# EAGLE design top_3-28-21 (EAGLE 9.6.1)
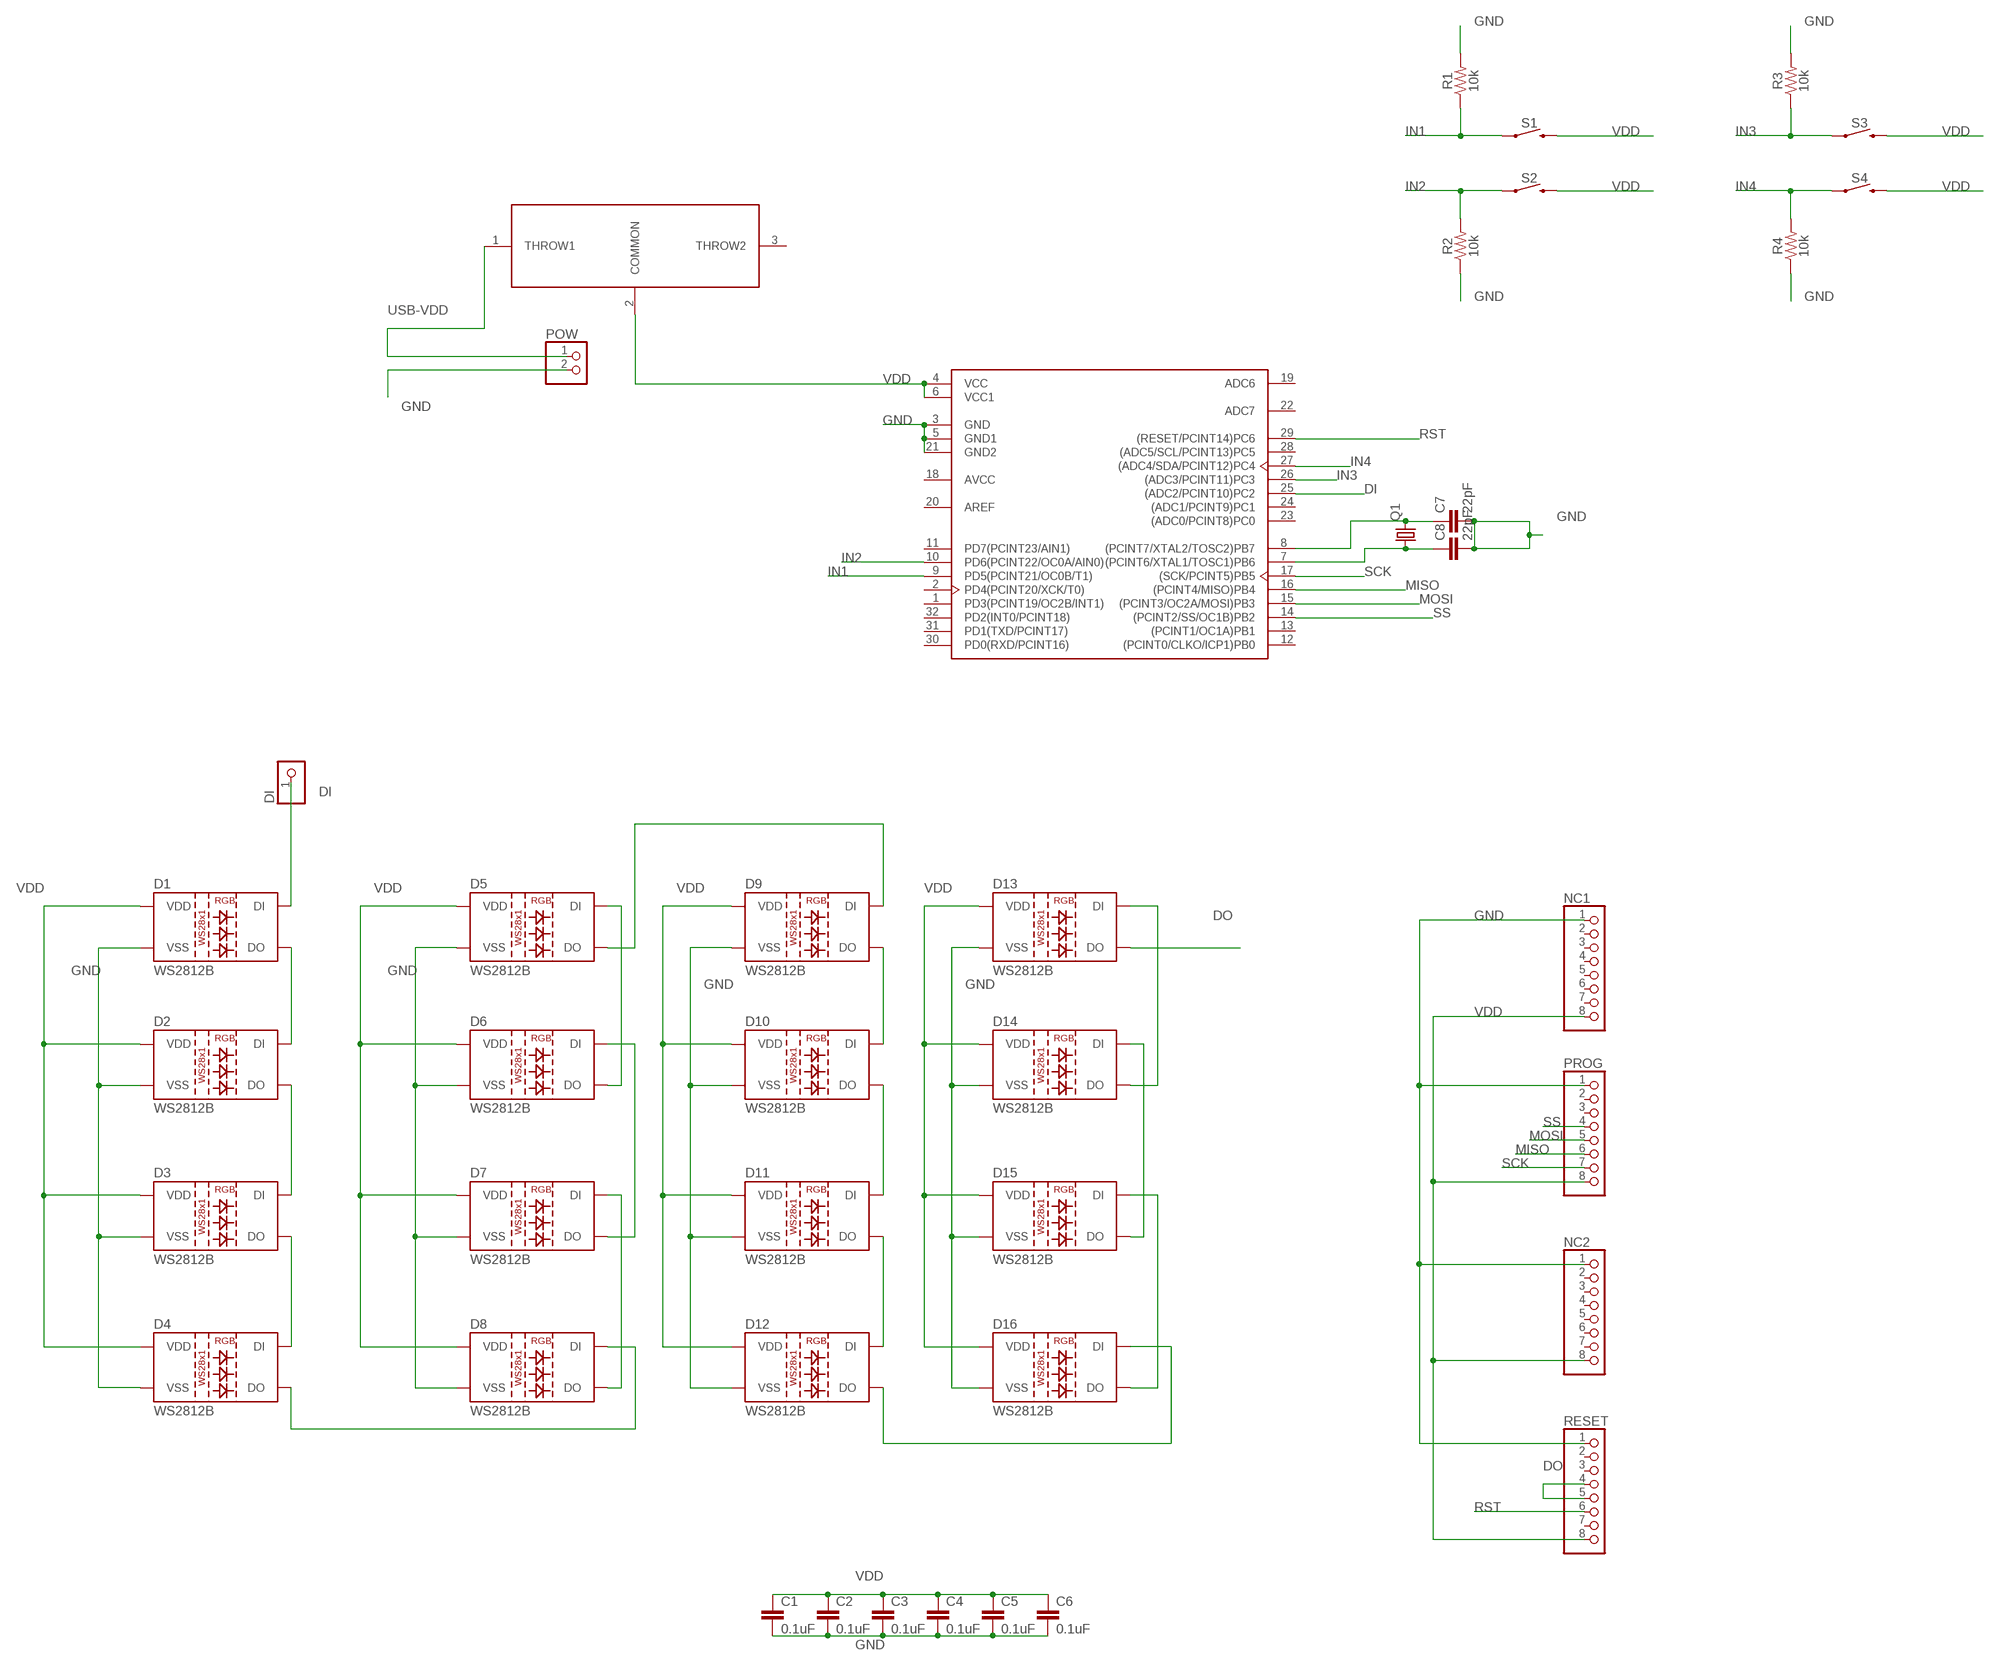
[diagram p0: schematic, sheet 1]

## Parts
C1  0.1uF  0.1UF-0603-25V-5%  [0603]
C2  0.1uF  0.1UF-0603-25V-5%  [0603]
C3  0.1uF  0.1UF-0603-25V-5%  [0603]
C4  0.1uF  0.1UF-0603-25V-5%  [0603]
C5  0.1uF  0.1UF-0603-25V-5%  [0603]
C6  0.1uF  0.1UF-0603-25V-5%  [0603]
C7  22pF  1.0UF-0805-25V-(+80/-20%)  [0805]
C8  22pF  1.0UF-0805-25V-(+80/-20%)  [0805]
D1  WS2812B  [WS2812B]
D2  WS2812B  [WS2812B]
D3  WS2812B  [WS2812B]
D4  WS2812B  [WS2812B]
D5  WS2812B  [WS2812B]
D6  WS2812B  [WS2812B]
D7  WS2812B  [WS2812B]
D8  WS2812B  [WS2812B]
D9  WS2812B  [WS2812B]
D10  WS2812B  [WS2812B]
D11  WS2812B  [WS2812B]
D12  WS2812B  [WS2812B]
D13  WS2812B  [WS2812B]
D14  WS2812B  [WS2812B]
D15  WS2812B  [WS2812B]
D16  WS2812B  [WS2812B]
DI  PINHD-1X1  [1X01]
IC1  ATMEGA328P-AU  [TQFP-32]
NC1  PINHD-1X8  [1X08]
NC2  PINHD-1X8  [1X08]
POW  PINHD-1X2  [1X02]
PROG  PINHD-1X8  [1X08]
Q1  CRYSTALHC49S  [HC49/S]
R1  10k  0.3OHM-0805-1/8W-1%  [0805]
R2  10k  0.3OHM-0805-1/8W-1%  [0805]
R3  10k  0.3OHM-0805-1/8W-1%  [0805]
R4  10k  0.3OHM-0805-1/8W-1%  [0805]
RESET  PINHD-1X8  [1X08]
S1  MOMENTARY-SWITCH-SPST-PTH-6.0MM  [TACTILE_SWITCH_PTH_6.0MM]
S2  MOMENTARY-SWITCH-SPST-PTH-6.0MM  [TACTILE_SWITCH_PTH_6.0MM]
S3  MOMENTARY-SWITCH-SPST-PTH-6.0MM  [TACTILE_SWITCH_PTH_6.0MM]
S4  MOMENTARY-SWITCH-SPST-PTH-6.0MM  [TACTILE_SWITCH_PTH_6.0MM]
U$2  SLIDE_SWITCH_1P2T  [SLIDE_SWITCH_1P2T]

## Nets
DI: D1.4(DI) DI.1 IC1.25((ADC2/PCINT10)PC2)
DO: D13.2(DO) RESET.4 RESET.5
GND: C1.2 C2.2 C3.2 C4.2 C5.2 C6.2 C7.2 C8.2 D1.3(VSS) D2.3(VSS) D3.3(VSS) D4.3(VSS) D5.3(VSS) D6.3(VSS) D7.3(VSS) D8.3(VSS) D9.3(VSS) D10.3(VSS) D11.3(VSS) D12.3(VSS) D13.3(VSS) D14.3(VSS) D15.3(VSS) D16.3(VSS) IC1.3(GND) IC1.5(GND1) IC1.21(GND2) NC1.1 NC2.1 POW.2 PROG.1 R1.2 R2.1 R3.2 R4.1 RESET.1
IN1: IC1.9(PD5(PCINT21/OC0B/T1)) R1.1 S1.1
IN2: IC1.10(PD6(PCINT22/OC0A/AIN0)) R2.2 S2.1
IN3: IC1.26((ADC3/PCINT11)PC3) R3.1 S3.1
IN4: IC1.27((ADC4/SDA/PCINT12)PC4) R4.2 S4.1
MISO: IC1.16((PCINT4/MISO)PB4) PROG.6
MOSI: IC1.15((PCINT3/OC2A/MOSI)PB3) PROG.5
N$1: D4.2(DO) D8.4(DI)
N$2: D7.4(DI) D8.2(DO)
N$3: D1.2(DO) D2.4(DI)
N$4: D2.2(DO) D3.4(DI)
N$5: D3.2(DO) D4.4(DI)
N$6: D6.4(DI) D7.2(DO)
N$7: D5.2(DO) D9.4(DI)
N$8: D12.2(DO) D16.4(DI)
N$9: D15.4(DI) D16.2(DO)
N$10: D9.2(DO) D10.4(DI)
N$11: D10.2(DO) D11.4(DI)
N$12: D11.2(DO) D12.4(DI)
N$13: D14.4(DI) D15.2(DO)
N$14: D13.4(DI) D14.2(DO)
N$15: C7.1 IC1.8((PCINT7/XTAL2/TOSC2)PB7) Q1.2
N$16: D5.4(DI) D6.2(DO)
N$17: C8.1 IC1.7((PCINT6/XTAL1/TOSC1)PB6) Q1.1
RST: IC1.29((RESET/PCINT14)PC6) RESET.6
SCK: IC1.17((SCK/PCINT5)PB5) PROG.7
SS: IC1.14((PCINT2/SS/OC1B)PB2) PROG.4
USB-VDD [pow_width]: POW.1 U$2.1(THROW1)
VDD [pow_width]: C1.1 C2.1 C3.1 C4.1 C5.1 C6.1 D1.1(VDD) D2.1(VDD) D3.1(VDD) D4.1(VDD) D5.1(VDD) D6.1(VDD) D7.1(VDD) D8.1(VDD) D9.1(VDD) D10.1(VDD) D11.1(VDD) D12.1(VDD) D13.1(VDD) D14.1(VDD) D15.1(VDD) D16.1(VDD) IC1.4(VCC) IC1.6(VCC1) NC1.8 NC2.8 PROG.8 RESET.8 S1.3 S2.3 S3.3 S4.3 U$2.2(COMMON)
Unconnected: IC1.1(PD3(PCINT19/OC2B/INT1)) IC1.2(PD4(PCINT20/XCK/T0)) IC1.11(PD7(PCINT23/AIN1)) IC1.12((PCINT0/CLKO/ICP1)PB0) IC1.13((PCINT1/OC1A)PB1) IC1.19(ADC6) IC1.22(ADC7) IC1.23((ADC0/PCINT8)PC0) IC1.24((ADC1/PCINT9)PC1) IC1.28((ADC5/SCL/PCINT13)PC5) IC1.30(PD0(RXD/PCINT16)) IC1.31(PD1(TXD/PCINT17)) IC1.32(PD2(INT0/PCINT18)) NC1.2 NC1.3 NC1.4 NC1.5 NC1.6 NC1.7 NC2.2 NC2.3 NC2.4 NC2.5 NC2.6 NC2.7 PROG.2 PROG.3 RESET.2 RESET.3 RESET.7 U$2.3(THROW2)

## Power pins joined to a net without a drawn wire
AREF: IC1.20(AREF)
AVCC: IC1.18(AVCC)

## Library data of the parts
C1-C6 = SparkFun-Capacitors:0.1UF: 0.1µF ceramic capacitors A capacitor is a passive two-terminal electrical component used to store electrical energy temporarily in an electric field.; PROD_ID: CAP-08604
C7 C8 = SparkFun-Capacitors:1.0UF: 1µF ceramic capacitors A capacitor is a passive two-terminal electrical component used to store electrical energy temporarily in an electric field.; PROD_ID: CAP-11625; VALUE: 1.0uF
D1-D16 = my-LED-cube:WS2812B: WS2812B SMD addressable RGB LED 5x5mm SMD LED with built-in controller IC. Color: Red/Green/Blue mC Rating: RGB: 390, 660, 180 mcd Forward Voltage: RGB: 2.0, 3.0, 3.0 V Packages:WS2812B SparkFun Products: Blynk Board - ESP8266 <https://www.sparkfun.com/products/13794>; PROD_ID: DIO-12503
DI = pinhead:PINHD-1X1: PIN HEADER
IC1 = Microcontroller:ATMEGA328P-AU: IC MCU 8BIT 32KB FLASH 32TQFP Manufacturer's datasheet <http://ww1.microchip.com/downloads/en/DeviceDoc/ATmega48A-PA-88A-PA-168A-PA-328-P-DS-DS40002061A.pdf>; CREATED_BY: PCBLayout.com; DIGIKEY_PART_NUMBER: ATMEGA328P-AU-ND; MANUFACTURER: Microchip Technology; MPN: ATMEGA328P-AU; PACKAGE: TQFP-32
NC1 NC2 PROG RESET = pinhead:PINHD-1X8: PIN HEADER
POW = pinhead:PINHD-1X2: PIN HEADER
Q1 = adafruit:CRYSTAL: CRYSTAL; OC_FARNELL: 1667008; OC_NEWARK: unknown
R1-R4 = SparkFun-Resistors:0.3OHM: 0.3Ω resistor A resistor is a passive two-terminal electrical component that implements electrical resistance as a circuit element. Resistors act to reduce current flow, and, at the same time, act to lower voltage levels within circuits. - Wikipedia; PROD_ID: RES-11622; VALUE: 0.3
S1-S4 = SparkFun-Switches:MOMENTARY-SWITCH-SPST: Momentary Switch (Pushbutton) - SPST Normally-open (NO) SPST momentary switches (buttons, pushbuttons). Variants PTH-12MM - 12mm square, through-hole Momentary Pushbutton Switch - 12mm Square <https://www.sparkfun.com/products/9190> (COM-09190) PTH-6.0MM, PTH-6.0MM-KIT - 6.0mm square, through-hole Mini Pushbutton Switch <https://www.sparkfun.com/products/97> (COM-00097) KIT package intended for soldering kit's - only one side of pads' copper is exposed. PTH-RIGHT-ANGLE-KIT - Right-angle, through-hole Right Angle Tactile Button <https://www.sparkfun.com/products/10791> - Used on SparkFun BigTime Watch Kit <https://www.sparkfun.com/products/11734> SMD-12MM - 12mm square, surface-mount Tactile Button - SMD (12mm) <https://www.sparkfun.com/products/12993> (COM-12993) Used on SparkFun PicoBoard <https://www.sparkfun.com/products/11888> SMD-4.5MM - 4.5mm Square Trackball Switch Used on SparkFun Blackberry Trackballer Breakout <https://www.sparkfun.com/products/13169> SMD-4.6MMX2.8MM - 4.60mm x 2.80mm, surface mount Used on SparkFun SAMD21 Mini Breakout <https://www.sparkfun.com/products/13664> SMD-5.2MM, SMD-5.2-REDUNDANT - 5.2mm square, surface-mount Mini Pushbutton Switch - SMD <https://www.sparkfun.com/products/8720> (COM-08720) Used on Arduino Pro Mini <https://www.sparkfun.com/products/11114> REDUNDANT package connects both switch circuits together SMD-6.0X3.5MM - 6.0 x 3.5mm, surface mount Momentary Reset Switch SMD <https://www.sparkfun.com/products/8229> (COM-08229) SMD-6.2MM-TALL - 6.2mm square, surface mount Tactile Button - SMD (6mm) <https://www.sparkfun.com/products/12992> Used on SparkFun Digital Sandbox <https://www.sparkfun.com/products/12651> SMD-RIGHT-ANGLE - Right-angle, surface mount Used on SparkFun Block for Intel® Edison - Arduino <https://www.sparkfun.com/products/13036>; PROD_ID: SWCH-08441; SF_SKU: COM-00097
U$2 = metronome:SLIDE_SWITCH_1P2T

## Net classes
1 pow_width: width 0.102 mm

## Board
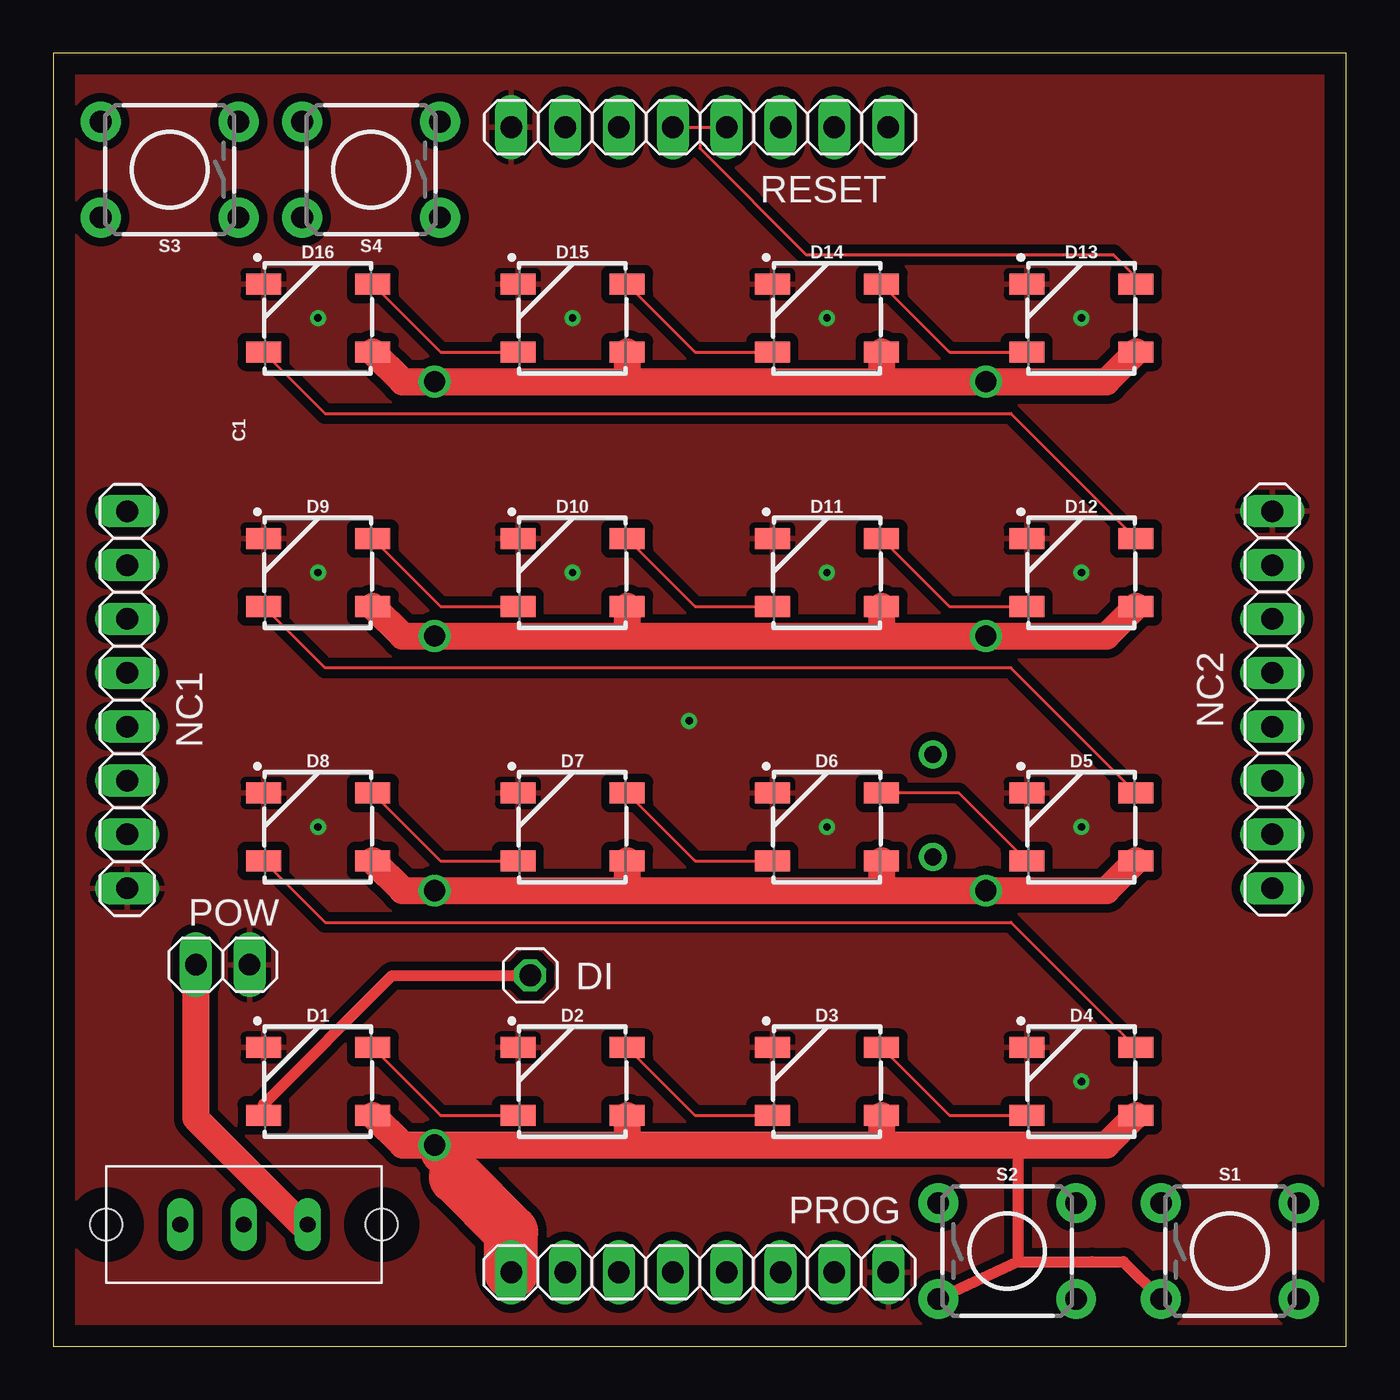
[diagram p1: board, top side]
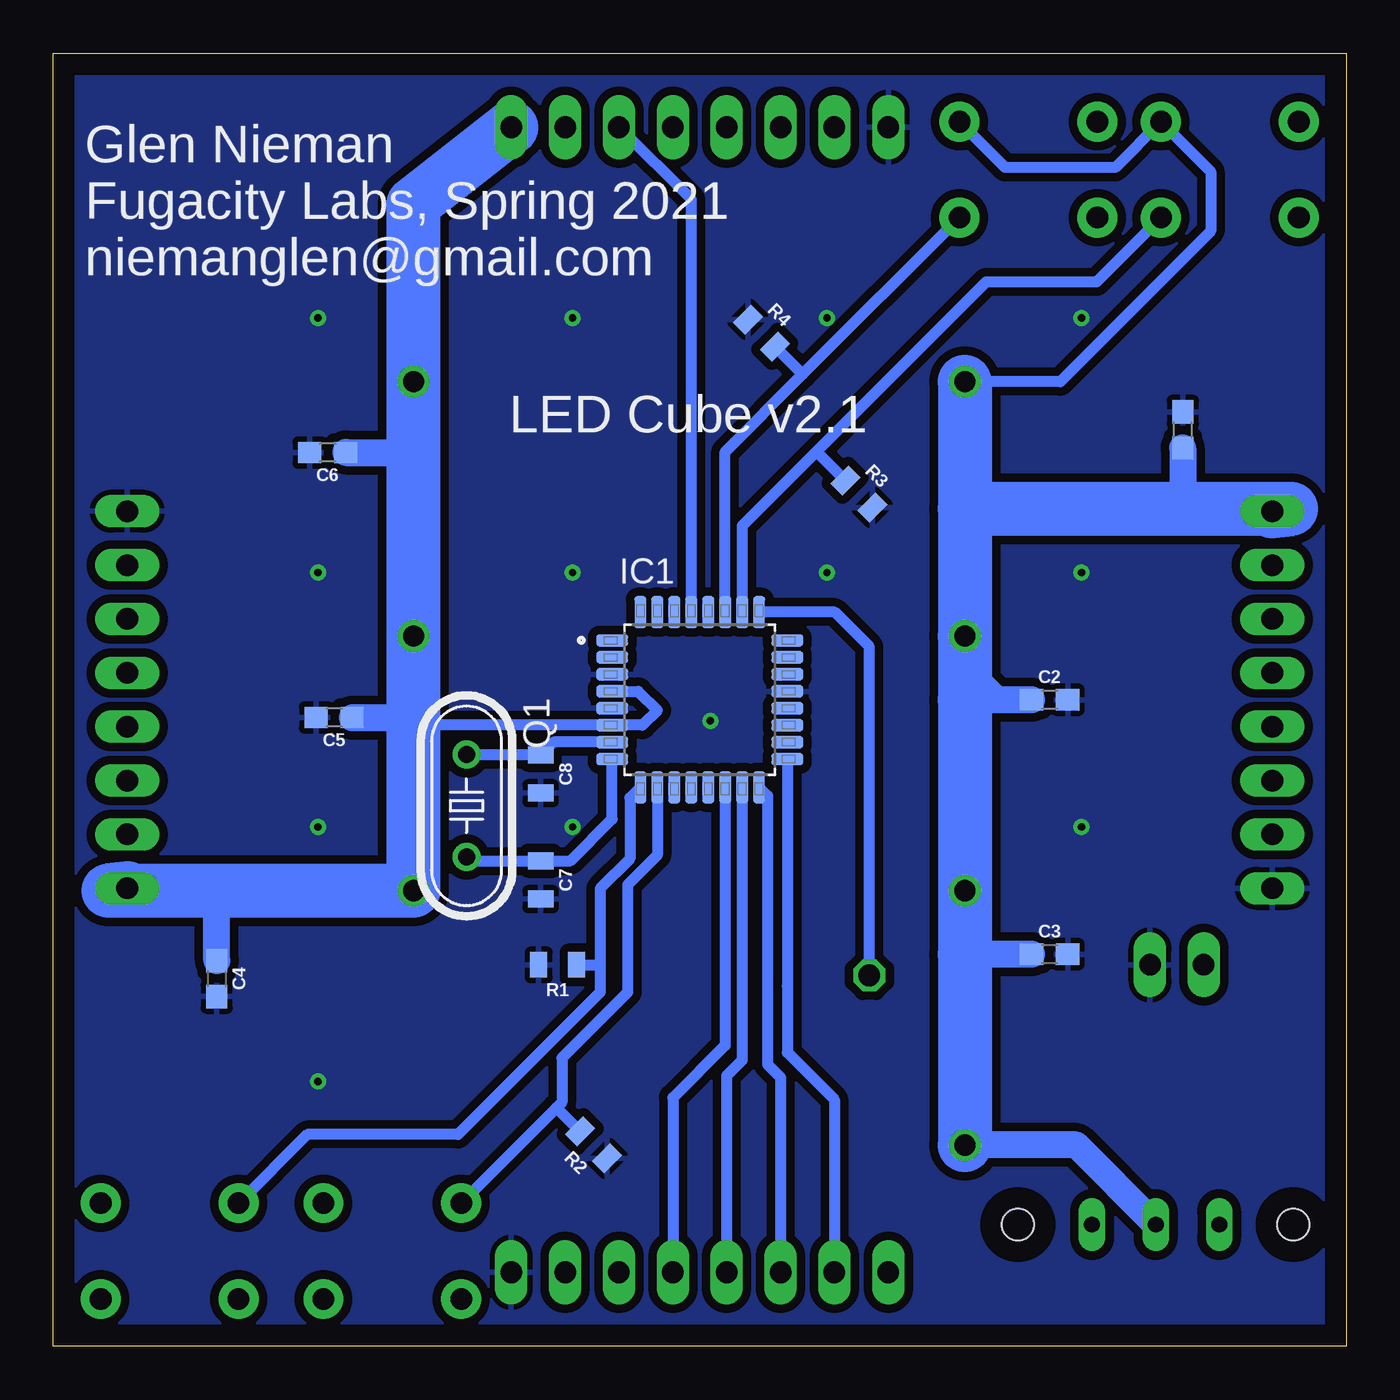
[diagram p2: board, bottom side, seen from below]

Size 61 x 61 mm. Coordinates in mm from the lower left corner, seen from the top.
Outline: 0,0 61,0 61,61 0,61 0,0
Copper layers (1*16): Top 0.035mm / dielectric 1.5mm / Bottom 0.035mm
Design rules "default *": minimum track width 6mil, minimum drill 0.35mm, track to track 6mil, track to pad 6mil, pad to pad 6mil, via to via 6mil, smd to smd 6mil, copper to edge 40mil, drill to drill 6mil, minimum pad ring 10mil, minimum via ring 8mil, stop-mask expansion 4mil, vias tented up to drill 100mil, thermal gap 10mil

### Footprints (pad centres in the part's own frame; a part is rotated, then mirrored left to right if it is on the bottom)
0603 = smd 1.1 x 1: 1 -0.85,0; 2 0.85,0
0805 = smd 0.8 x 1.2: 1 -0.9,0; 2 0.9,0
WS2812B = smd 1.651 x 1: 1 2.577,-1.6; 2 2.577,1.6; 3 -2.577,1.6; 4 -2.577,-1.6
1X01 = drill 1.016 octagon: 1 0,0
TQFP-32 = smd 1.5 x 0.57: 1 -4.13,2.8; 2 -4.13,2; 3 -4.13,1.2; 4 -4.13,0.4; 5 -4.13,-0.4; 6 -4.13,-1.2; 7 -4.13,-2; 8 -4.13,-2.8; 17 4.13,-2.8; 18 4.13,-2; 19 4.13,-1.2; 20 4.13,-0.4; 21 4.13,0.4; 22 4.13,1.2; 23 4.13,2; 24 4.13,2.8 | smd 0.57 x 1.5: 9 -2.8,-4.13; 10 -2,-4.13; 11 -1.2,-4.13; 12 -0.4,-4.13; 13 0.4,-4.13; 14 1.2,-4.13; 15 2,-4.13; 16 2.8,-4.13; 25 2.8,4.13; 26 2,4.13; 27 1.2,4.13; 28 0.4,4.13; 29 -0.4,4.13; 30 -1.2,4.13; 31 -2,4.13; 32 -2.8,4.13
1X08 = drill 1.016 long: 1 -8.89,0; 2 -6.35,0; 3 -3.81,0; 4 -1.27,0; 5 1.27,0; 6 3.81,0; 7 6.35,0; 8 8.89,0
1X02 = drill 1.016 long: 1 -1.27,0; 2 1.27,0
HC49/S = drill 0.813: 1 -2.413,0; 2 2.413,0
TACTILE_SWITCH_PTH_6.0MM = drill 1.016 pad 1.88: 1 -3.251,2.261; 2 3.251,2.261; 3 -3.251,-2.261; 4 3.251,-2.261
SLIDE_SWITCH_1P2T = drill 0.75 long: 1 3.5,2.75; 2 6.5,2.75; 3 9.5,2.75 | hole 1.5: 0,2.75; 13,2.75

### Placement (x,y rotation side)
C1  7.72,43.22 90 bottom
C2  14,30.5 0 bottom
C3  14,18.5 0 bottom
C4  53.28,17.35 270 bottom
C5  47.74,29.66 180 bottom
C6  48.05,42.16 180 bottom
C7  38,22 270 bottom
C8  38,27 270 bottom
D1  12.5,12.5 0 top
D2  24.5,12.5 0 top
D3  36.5,12.5 0 top
D4  48.5,12.5 0 top
D5  48.5,24.5 0 top
D6  36.5,24.5 0 top
D7  24.5,24.5 0 top
D8  12.5,24.5 0 top
D9  12.5,36.5 0 top
D10  24.5,36.5 0 top
D11  36.5,36.5 0 top
D12  48.5,36.5 0 top
D13  48.5,48.5 0 top
D14  36.5,48.5 0 top
D15  24.5,48.5 0 top
D16  12.5,48.5 0 top
DI  22.5,17.5 0 top
IC1  30.5,30.5 0 bottom
NC1  3.5,30.5 90 top
NC2  57.5,30.5 270 top
POW  8,18 0 top
PROG  30.5,3.5 180 top
Q1  41.5,25.5 270 bottom
R1  37.2,18 180 bottom
R2  35.5,9.5 135 bottom
R3  23,40.2 315 bottom
R4  27.6,47.8 315 bottom
RESET  30.5,57.5 0 top
S1  55.5,4.5 0 top
S2  45,4.5 0 top
S3  5.5,55.5 180 top
S4  15,55.5 180 top
U$2  15.5,8.5 180 top

### Tracks (layer width: path | path; a pad name or v marks a point on that pad's centre or on a via)
DI
  Top 0.508: D1.4 9.92,11.42 16,17.5 DI.1
  Bottom 0.508: IC1.25 24.13,34.63 22.5,33 DI.1
DO
  Top 0.152: RESET.4 30.5,57.5 | 30.5,57.5 RESET.5 | 30.5,57.5 30.5,56.5 35.5,51.5 50,51.5 51.08,50.42 D13.2
GND  (via drill 0.35)
  other vias: 30,29.5 48.5,12.5 48.5,24.5 12.5,24.5 12.5,36.5 24.5,36.5 36.5,36.5 48.5,36.5 48.5,48.5 36.5,48.5 24.5,48.5 12.5,48.5 36.5,24.5
  pour Top (isolate 0.406): 0,0 0,61 61,61 61,0
  pour Bottom (isolate 0.406): 0,0 0,61 61,61 61,0
IN1
  Bottom 0.508: IC1.9 33.8,25.87 33.8,23 35.2,21.6 35.2,18 | 35.2,18 35.2,16.7 41.9,10 49.01,10 S1.1 | R1.1 35.2,18
IN2
  Bottom 0.508: 37.26,11.26 37.01,11.51 37.01,13.61 33.9,16.71 33.9,21.77 32.5,23.17 IC1.10 | 36.64,10.64 | R2.2 36.64,10.64 | 36.64,10.64 37.26,11.26 | 37.26,11.26 S2.1
IN3
  Bottom 0.508: S3.1 11.79,50.2 17,50.2 25,42.2 | IC1.26 28.5,38.7 25,42.2 | R3.1 25,42.2 | 25,42.2
IN4
  Bottom 0.508: IC1.27 29.3,42.19 25.64,45.84 | 25.64,45.84 S4.1 | R4.2 25.64,45.84 | 25.64,45.84
MISO
  Bottom 0.508: IC1.16 27.3,25.97 27.3,18.5 27.3,13.3 26.69,12.69 PROG.6
MOSI
  Bottom 0.508: PROG.5 29.23,12.77 28.5,13.5 28.5,15.6 IC1.15
N$1
  Top 0.152: D8.4 12.82,20 45.18,20 D4.2
N$2
  Top 0.152: D8.2 18.28,22.9 D7.4
N$3
  Top 0.152: D1.2 18.28,10.9 D2.4
N$4
  Top 0.152: D2.2 30.28,10.9 D3.4
N$5
  Top 0.152: D3.2 42.28,10.9 D4.4
N$6
  Top 0.152: D7.2 30.28,22.9 D6.4
N$7
  Top 0.152: D5.2 45.18,32 12.82,32 D9.4
N$8
  Top 0.152: D16.4 12.82,44 45.18,44 D12.2
N$9
  Top 0.152: D16.2 18.28,46.9 D15.4
N$10
  Top 0.152: D9.2 18.28,34.9 D10.4
N$11
  Top 0.152: D10.2 30.28,34.9 D11.4
N$12
  Top 0.152: D11.2 42.28,34.9 D12.4
N$13
  Top 0.152: D15.2 30.28,46.9 D14.4
N$14
  Top 0.152: D14.2 42.28,46.9 D13.4
N$15
  Bottom 0.508: Q1.2 41.31,22.9 C7.1 36.6,22.9 34.63,24.87 IC1.8
N$16
  Top 0.152: D5.4 42.72,26.1 D6.2
N$17
  Bottom 0.508: IC1.7 37.4,28.5 C8.1 41.49,27.9 Q1.1
RST
  Bottom 0.508: IC1.29 30.9,54.1 RESET.6
SCK
  Bottom 0.508: IC1.17 26.37,17 26.37,13.87 24.15,11.65 PROG.7
SS
  Bottom 0.152: 29.3,19.3
  Bottom 0.508: IC1.14 29.3,19.3 | 29.3,19.3 29.3,14.2 31.77,11.73 PROG.4
USB-VDD
  Top 1.27: U$2.1 11.75,5.75 6.73,10.77 POW.1
VDD  (via drill 1)
  Top 0.508: 45.5,9.5 45.5,3.99 | 45.5,3.99 S2.3 | 45.5,3.99 48.99,3.99 49,4 50.49,4 S1.3
  Top 1.27: D16.1 16.48,45.5 v18,45.5 27,45.5 | D13.1 49.68,45.5 v44,45.5 39,45.5 | 27,45.5 39,45.5 | D14.1 39.08,45.58 39,45.5 | D15.1 27.08,45.58 27,45.5 | D9.1 16.48,33.5 v18,33.5 27,33.5 | D12.1 49.68,33.5 v44,33.5 39,33.5 | 27,33.5 39,33.5 | D11.1 39.08,33.58 39,33.5 | D10.1 27.08,33.58 27,33.5 | D8.1 16.48,21.5 v18,21.5 24.2,21.5 27,21.5 | D5.1 49.68,21.5 v44,21.5 39,21.5 | 27,21.5 39,21.5 | D6.1 39.08,21.58 39,21.5 | D7.1 27.08,21.58 27,21.5 | D1.1 16.48,9.5 v18,9.5 | D4.1 49.68,9.5 45.5,9.5 39,9.5 | v18,9.5 27,9.5 | 27,9.5 39,9.5 | D2.1 27.08,9.58 27,9.5 | D3.1 39.08,9.58 39,9.5 | 19,8 18,9 v18,9.5
  Top 2.54: PROG.8 21.61,5.39 19,8
  Bottom 0.508: IC1.4 33.4,30.9 32.5,30 33.2,29.3 IC1.6 43.5,29.3 43.7,29.3 44,29 | S4.3 16.09,55.6 10.91,55.6 S3.3 6.4,55.41 6.4,52.6 13.5,45.5 v18,45.5
  Bottom 1.27: U$2.2 12.75,9.5 v18,9.5 | C1.1 7.72,39.72 7.5,39.5 | C2.1 16.5,30.5 | 16.5,30.5 18,30.5 | C3.1 18,18.5 | C5.1 43.86,29.66 43.5,29.3 | C6.1 44.16,42.16 44,42 | C4.1 53.28,21.28 53.5,21.5 | 16.5,30.5 18,32 v18,33.5
  Bottom 2.54: v18,45.5 18,39.5 | 18,39.5 v18,33.5 18,30.5 18,18.5 v18,9.5 | NC1.8 2.61,39.5 7.5,39.5 18,39.5 | NC2.8 58.39,21.5 53.5,21.5 v44,21.5 44,29 44,42 v44,45.5 44,53.89 RESET.8

### Text on the board
bPlace: Glen Nieman / Fugacity Labs, Spring 2021 / niemanglen@gmail.com | LED Cube v2.1